# EAGLE design ecg (EAGLE 9.4.1)
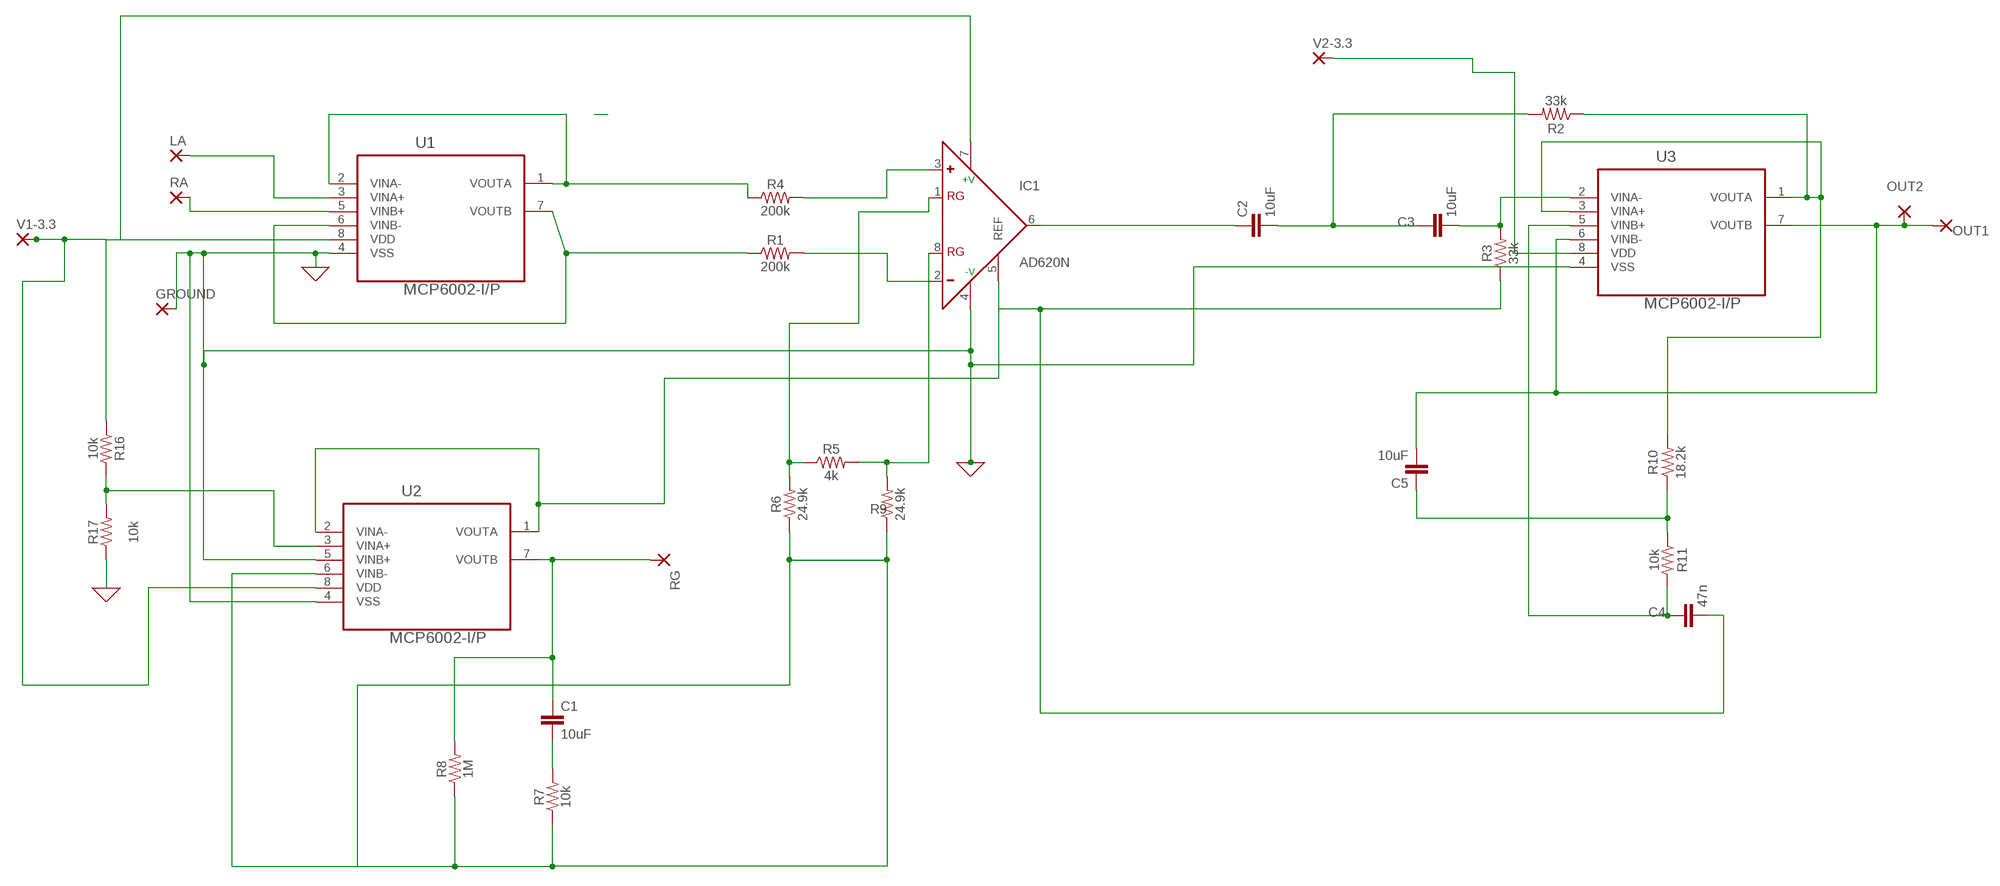
[diagram p0: schematic, sheet 1]

## Parts
C1  10uF  0.1UF-KIT-EZ-50V-20%  [CAP-PTH-SMALL-KIT]
C2  10uF  0.1UF-KIT-EZ-50V-20%  [CAP-PTH-SMALL-KIT]
C3  10uF  0.1UF-KIT-EZ-50V-20%  [CAP-PTH-SMALL-KIT]
C4  47n  0.1UF-KIT-EZ-50V-20%  [CAP-PTH-SMALL-KIT]
C5  10uF  0.1UF-KIT-EZ-50V-20%  [CAP-PTH-SMALL-KIT]
GROUND  3,81/1,4  [3,81/1,4]
IC1  AD620N  [DIL08]
LA  3,81/1,4  [3,81/1,4]
OUT1  3,81/1,4  [3,81/1,4]
OUT2  3,81/1,4  [3,81/1,4]
R1  200k  15KOHM-HORIZ-1/4W-5%  [AXIAL-0.3]
R2  33k  15KOHM-HORIZ-1/4W-5%  [AXIAL-0.3]
R3  33k  15KOHM-HORIZ-1/4W-5%  [AXIAL-0.3]
R4  200k  15KOHM-HORIZ-1/4W-5%  [AXIAL-0.3]
R5  4k  15KOHM-HORIZ-1/4W-5%  [AXIAL-0.3]
R6  24.9k  15KOHM-HORIZ-1/4W-5%  [AXIAL-0.3]
R7  10k  15KOHM-HORIZ-1/4W-5%  [AXIAL-0.3]
R8  1M  15KOHM-HORIZ-1/4W-5%  [AXIAL-0.3]
R9  24.9k  15KOHM-HORIZ-1/4W-5%  [AXIAL-0.3]
R10  18.2k  15KOHM-HORIZ-1/4W-5%  [AXIAL-0.3]
R11  10k  15KOHM-HORIZ-1/4W-5%  [AXIAL-0.3]
R16  10k  15KOHM-HORIZ-1/4W-5%  [AXIAL-0.3]
R17  10k  15KOHM-HORIZ-1/4W-5%  [AXIAL-0.3]
RA  3,81/1,4  [3,81/1,4]
RG  3,81/1,4  [3,81/1,4]
U1  MCP6002-I/P  [DIP254P762X533-8]
U2  MCP6002-I/P  [DIP254P762X533-8]
U3  MCP6002-I/P  [DIP254P762X533-8]
V1-3.3  3,81/1,4  [3,81/1,4]
V2-3.3  3,81/1,4  [3,81/1,4]

## Nets
0: GROUND.1(P) IC1.4(-V) R17.P$1 U1.4(VSS) U2.4(VSS) U2.5(VINB+) U3.4(VSS) ; supply symbol labelled GND
N$1: R6.P$1 R7.P$1 R8.P$1 R9.P$1 U2.6(VINB-)
N$2: IC1.7(+V) R16.P$1 U1.8(VDD) U2.8(VDD) V1-3.3.1(P)
N$3: C1.2 R7.P$2
N$4: C4.2 IC1.5(REF) R3.P$1 U2.1(VOUTA) U2.2(VINA-)
N$6: R16.P$2 R17.P$2 U2.3(VINA+)
N$7: R2.P$1 R10.P$2 U3.1(VOUTA) U3.3(VINA+)
N$8: LA.1(P) U1.3(VINA+)
N$9: RA.1(P) U1.5(VINB+)
N$10: R1.P$1 U1.6(VINB-) U1.7(VOUTB)
N$11: R4.P$1 U1.1(VOUTA) U1.2(VINA-)
N$12: IC1.3(+) R4.P$2
N$13: U3.8(VDD) V2-3.3.1(P)
N$14: C2.2 C3.1 R2.P$2
N$15: C2.1 IC1.6(OUT)
N$16: C3.2 R3.P$2 U3.2(VINA-)
N$17: C5.1 R10.P$1 R11.P$1
N$18: C4.1 R11.P$2 U3.5(VINB+)
N$20: C5.2 OUT1.1(P) OUT2.1(P) U3.6(VINB-) U3.7(VOUTB)
N$21: IC1.2(-) R1.P$2
N$22: C1.1 R8.P$2 RG.1(P) U2.7(VOUTB)
N$24: IC1.1(RG) R5.P$1 R6.P$2
N$25: IC1.8(RG) R5.P$2 R9.P$2

## Library data of the parts
C1-C5 = SparkFun-Capacitors:0.1UF: 0.1µF ceramic capacitors A capacitor is a passive two-terminal electrical component used to store electrical energy temporarily in an electric field.; PROD_ID: CAP-08370; VALUE: 0.1uF
GROUND LA OUT1 OUT2 RA RG V1-3.3 V2-3.3 = wirepad:3,81/1,4: THROUGH-HOLE PAD
IC1 = analog-devices:AD620: Low Cost, Low Power, Instrumentation Amplifier Source: http://www.analog.com/UploadedFiles/Data_Sheets/37793330023930AD620_e.pdf; MF: ALTERA CORPORATION; MPN: AD620AN; OC_FARNELL: 1523782; OC_NEWARK: 05F7108
R1-R11 R16 R17 = SparkFun-Resistors:15KOHM: 15kΩ resistor A resistor is a passive two-terminal electrical component that implements electrical resistance as a circuit element. Resistors act to reduce current flow, and, at the same time, act to lower voltage levels within circuits. - Wikipedia; PROD_ID: RES-11360; VALUE: 15k
U1-U3 = MCP6002-I_P (1):MCP6002-I/P: IC OPAMP 1.8V 1MHZ DUAL; DESCRIPTION: MCP6002 Series 6 V 1 MHz Through Hole Low-Power Operational Amplifier - PDIP-8; DIGI-KEY_PART_NUMBER: MCP6002-I/P-ND; DIGI-KEY_PURCHASE_URL: https://www.digikey.com/product-detail/en/microchip-technology/MCP6002-I-P/MCP6002-I-P-ND/500875?utm_source=snapeda&utm_medium=aggregator&utm_campaign=symbol; MF: Microchip; MP: MCP6002-I/P; PACKAGE: DIP-8 Microchip

## Board
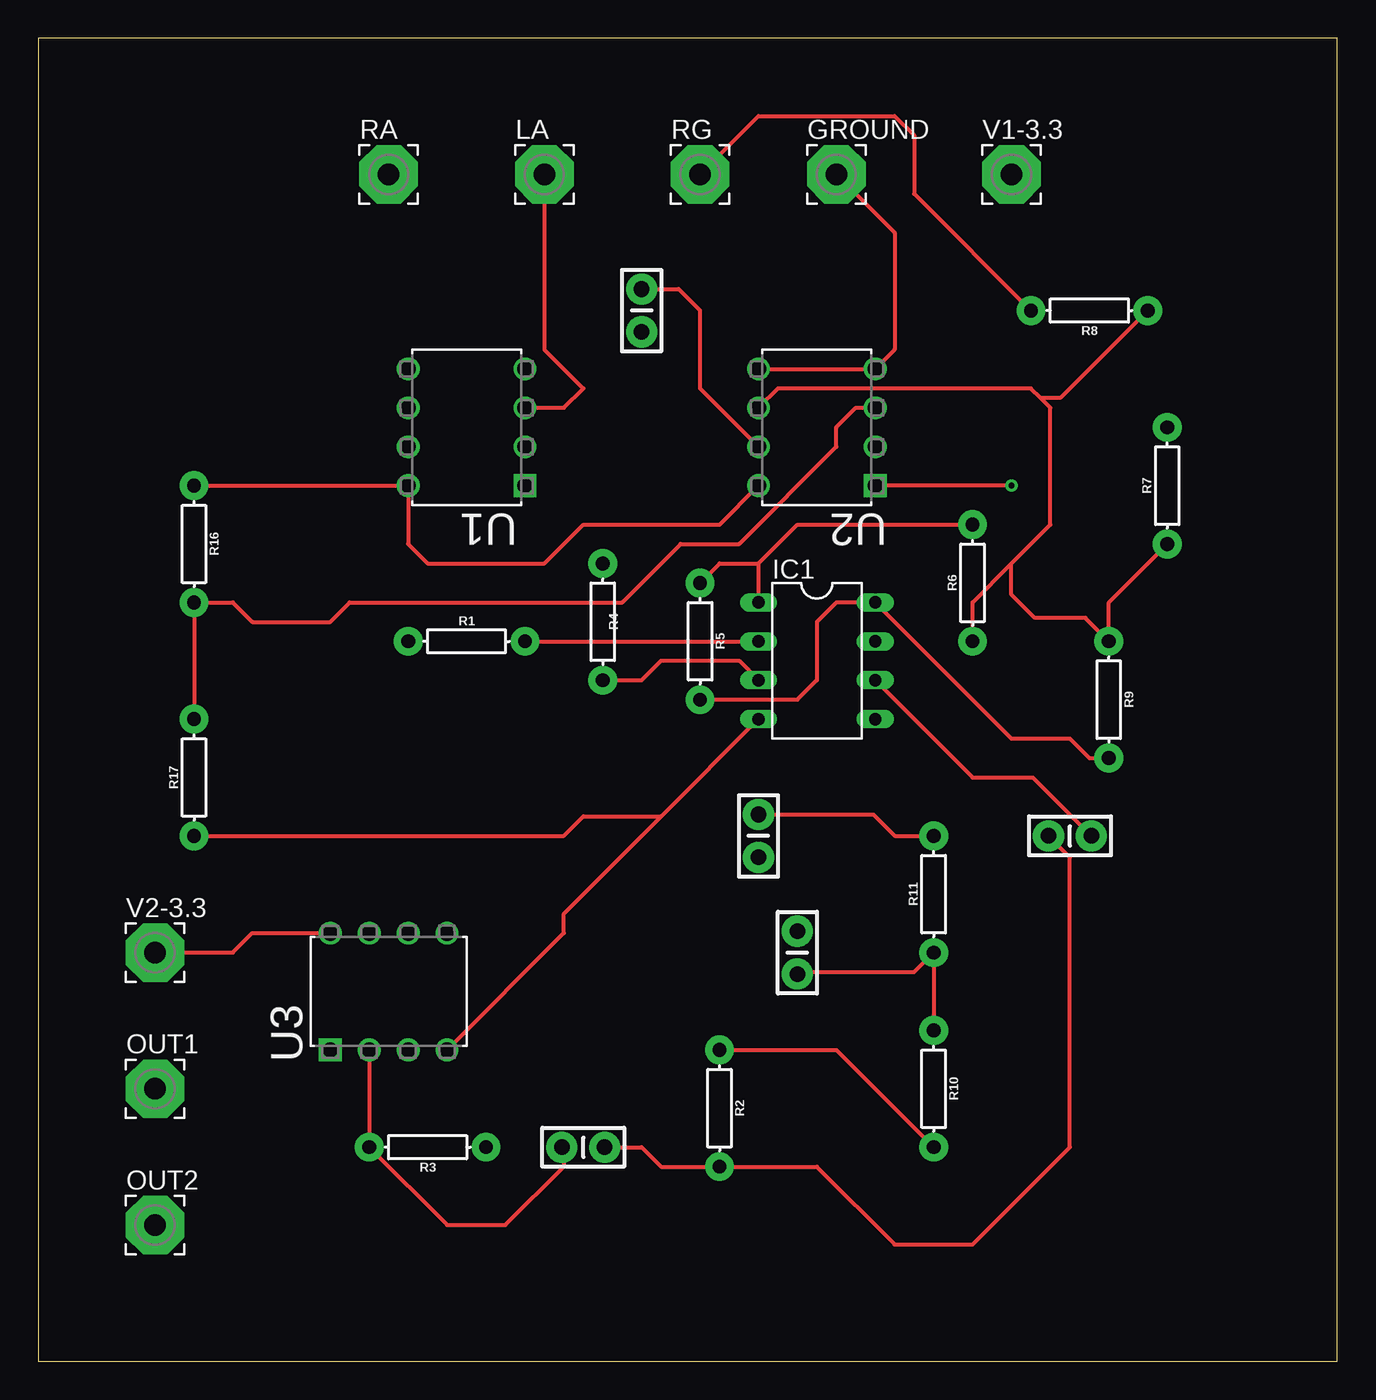
[diagram p1: board, top side]
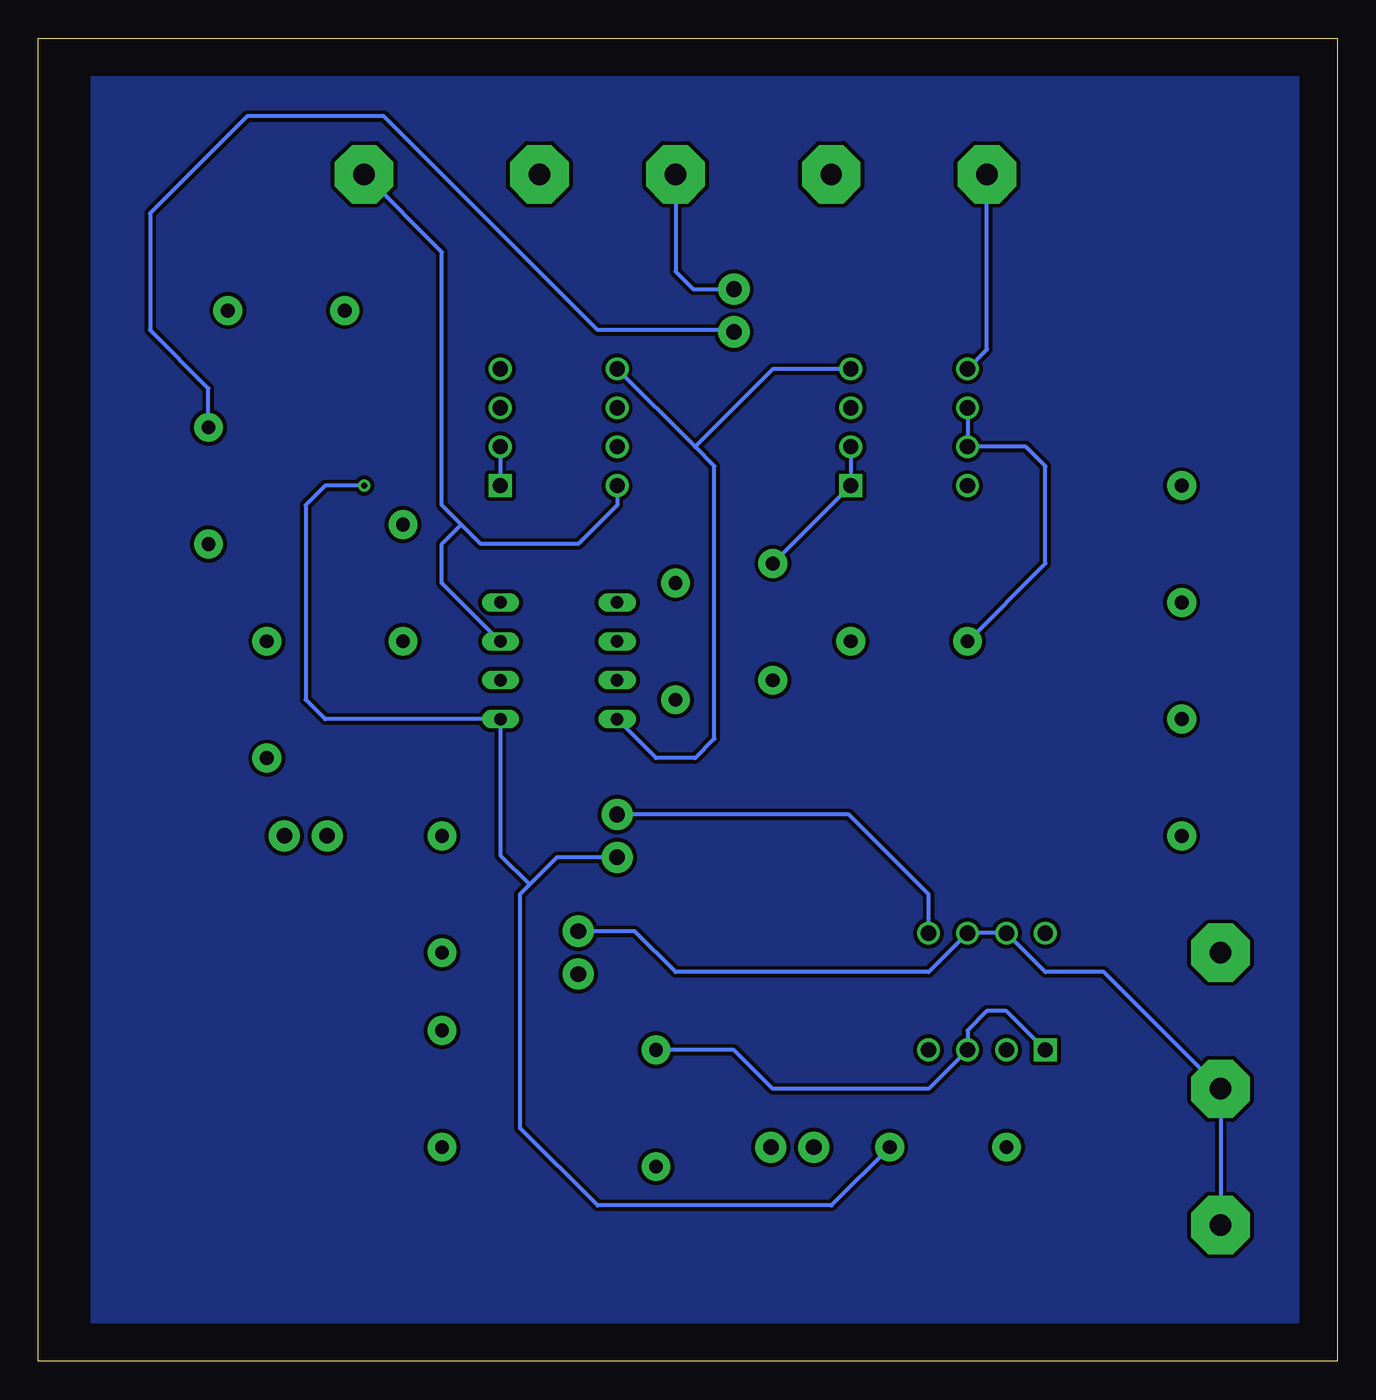
[diagram p2: board, bottom side, seen from below]

Size 84.76 x 86.35 mm. Coordinates in mm from the lower left corner, seen from the top.
Outline: 0,0 84.76,0 84.76,86.35 0,86.35 0,0
Copper layers (1*16): Top 0.035mm / dielectric 1.5mm / Bottom 0.035mm
Design rules "Standard": minimum track width 10mil, minimum drill 15mil, track to track 10mil, track to pad 10mil, pad to pad 10mil, via to via 10mil, smd to smd 10mil, copper to edge 20mil, drill to drill 10mil, minimum pad ring 8mil, minimum via ring 8mil, stop-mask expansion 4mil, vias tented up to drill 0mil, thermal gap 10mil

### Footprints (pad centres in the part's own frame; a part is rotated, then mirrored left to right if it is on the bottom)
CAP-PTH-SMALL-KIT = drill 1.016 pad 2.032: 1 -1.397,0; 2 1.397,0
3,81/1,4 = drill 1.397 pad 3.81 octagon: 1 0,0
DIL08 = drill 0.813 long: 1 -3.81,-3.81; 2 -1.27,-3.81; 3 1.27,-3.81; 4 3.81,-3.81; 5 3.81,3.81; 6 1.27,3.81; 7 -1.27,3.81; 8 -3.81,3.81
AXIAL-0.3 = drill 0.9 pad 1.88: P$1 -3.81,0; P$2 3.81,0
DIP254P762X533-8 = drill 0.991 square: 1 -7.62,7.62 | drill 0.991: 2 -7.62,5.08; 3 -7.62,2.54; 4 -7.62,0; 5 0,0; 6 0,2.54; 7 0,5.08; 8 0,7.62

### Placement (x,y rotation side)
C1  39.37,68.58 270 top
C2  67.31,34.29 180 top
C3  35.56,13.97 180 top
C4  46.99,34.29 270 top
C5  49.53,26.67 90 top
GROUND  52.07,77.47 0 top
IC1  50.8,45.72 270 top
LA  33.02,77.47 0 top
OUT1  7.62,17.78 0 top
OUT2  7.62,8.89 0 top
R1  27.94,46.99 0 top
R2  44.45,16.51 270 top
R3  25.4,13.97 180 top
R4  36.83,48.26 270 top
R5  43.18,46.99 270 top
R6  60.96,50.8 90 top
R7  73.66,57.15 90 top
R8  68.58,68.58 180 top
R9  69.85,43.18 270 top
R10  58.42,17.78 270 top
R11  58.42,30.48 90 top
R16  10.16,53.34 270 top
R17  10.16,38.1 90 top
RA  22.86,77.47 0 top
RG  43.18,77.47 0 top
U1  24.13,64.77 180 top
U2  46.99,64.77 180 top
U3  26.67,27.94 90 top
V1-3.3  63.5,77.47 0 top
V2-3.3  7.62,26.67 0 top

### Tracks (layer width: path | path; a pad name or v marks a point on that pad's centre or on a via)
0
  Top 0.254: U3.4 34.29,27.94 34.29,29.21 40.64,35.56 | 40.64,35.56 IC1.4 | R17.P$1 34.29,34.29 35.56,35.56 40.64,35.56 | GROUND.1 55.88,73.66 55.88,66.04 U2.4 U2.5
  Bottom 0.254: IC1.4 44.45,39.37 41.91,39.37 40.64,40.64 40.64,58.42 41.91,59.69 | 41.91,59.69 U2.5 | U1.4 36.83,64.77 41.91,59.69
GND
  pour Bottom: 2.54,83.82 2.54,2.54 81.28,2.54 81.28,83.82
N$1
  Top 0.254: R6.P$1 60.96,49.53 63.5,52.07 | 63.5,52.07 66.04,54.61 66.04,62.23 65.41,62.87 | 65.41,62.87 64.77,63.5 48.26,63.5 U2.6 | 63.5,52.07 63.5,50.04 65.02,48.51 68.33,48.51 R9.P$1 69.85,49.53 R7.P$1 | R8.P$1 66.68,62.87 65.41,62.87
N$2
  Top 0.254: U2.8 44.45,54.61 35.56,54.61 33.02,52.07 25.4,52.07 24.13,53.34 U1.8 R16.P$1
  Bottom 0.254: U2.8 46.99,55.88 49.53,53.34 55.88,53.34 57.15,54.61 | V1-3.3.1 58.42,72.39 58.42,55.88 57.15,54.61 | IC1.7 58.42,50.8 58.42,53.34 57.15,54.61
N$3
  Bottom 0.254: C1.2 39.5,67.31 48.26,67.31 62.23,81.28 71.12,81.28 77.47,74.93 77.47,67.31 73.66,63.5 R7.P$2
N$4  (via drill 0.38)
  Top 0.254: v63.5,57.15 U2.1
  Bottom 0.254: R3.P$1 33.02,10.16 48.26,10.16 53.34,15.24 53.34,30.48 52.7,31.11 | C4.2 50.93,32.89 52.7,31.11 | 52.7,31.11 54.61,33.02 IC1.5 66.04,41.91 67.31,43.18 67.31,55.88 66.04,57.15 v63.5,57.15 | U2.2 U2.1
N$6
  Top 0.254: R17.P$2 R16.P$2 12.7,49.53 13.97,48.26 19.05,48.26 20.32,49.53 38.1,49.53 41.91,53.34 45.72,53.34 52.07,59.69 52.07,60.96 53.34,62.23 U2.3
N$7
  Top 0.254: R2.P$1 52.07,20.32 R10.P$2
  Bottom 0.254: U3.1 21.59,22.86 22.86,22.86 24.13,21.59 U3.3 26.67,17.78 36.83,17.78 39.37,20.32 R2.P$1
N$8
  Top 0.254: LA.1 33.02,66.04 35.56,63.5 34.29,62.23 U1.3
N$9
  Bottom 0.254: U1.5 22.86,66.04 RA.1
N$10
  Bottom 0.254: R1.P$1 19.05,52.07 19.05,58.42 20.32,59.69 U1.7 U1.6
N$11
  Bottom 0.254: U1.2 U1.1 R4.P$1
N$12
  Top 0.254: IC1.3 45.72,45.72 40.64,45.72 39.37,44.45 R4.P$2
N$13
  Top 0.254: V2-3.3.1 12.7,26.67 13.97,27.94 U3.8
N$14
  Top 0.254: C2.2 67.31,32.89 67.31,13.97 60.96,7.62 55.88,7.62 50.8,12.7 R2.P$2 40.64,12.7 39.37,13.97 C3.1
N$15
  Top 0.254: C2.1 64.9,38.1 60.96,38.1 IC1.6
N$16
  Top 0.254: U3.2 R3.P$2 26.67,8.89 30.48,8.89 34.29,12.7 34.29,13.97 C3.2
N$17
  Top 0.254: R10.P$1 R11.P$1 57.15,25.4 49.66,25.4 C5.1
N$18
  Top 0.254: R11.P$2 55.88,34.29 54.48,35.69 C4.1
  Bottom 0.254: U3.5 26.67,30.48 31.88,35.69 C4.1
N$20
  Bottom 0.254: OUT2.1 OUT1.1 15.24,25.4 19.05,25.4 U3.7 U3.6 26.67,25.4 43.18,25.4 45.85,28.07 C5.2
N$21
  Top 0.254: R1.P$2 IC1.2
N$22
  Top 0.254: RG.1 46.99,81.28 55.88,81.28 57.15,80.01 57.15,76.2 R8.P$2 | U2.7 43.18,63.5 43.18,68.58 41.78,69.98 C1.1
  Bottom 0.254: RG.1 43.18,71.12 42.04,69.98 C1.1
N$24
  Top 0.254: R5.P$1 44.45,52.07 46.99,52.07 | 46.99,52.07 IC1.1 | R6.P$2 49.53,54.61 46.99,52.07
N$25
  Top 0.254: R5.P$2 49.53,43.18 50.8,44.45 50.8,48.26 52.07,49.53 IC1.8 63.5,40.64 67.31,40.64 68.58,39.37 R9.P$2